# EAGLE design BLE_revb (EAGLE 7.7.0)

## Sheet 1 of 2
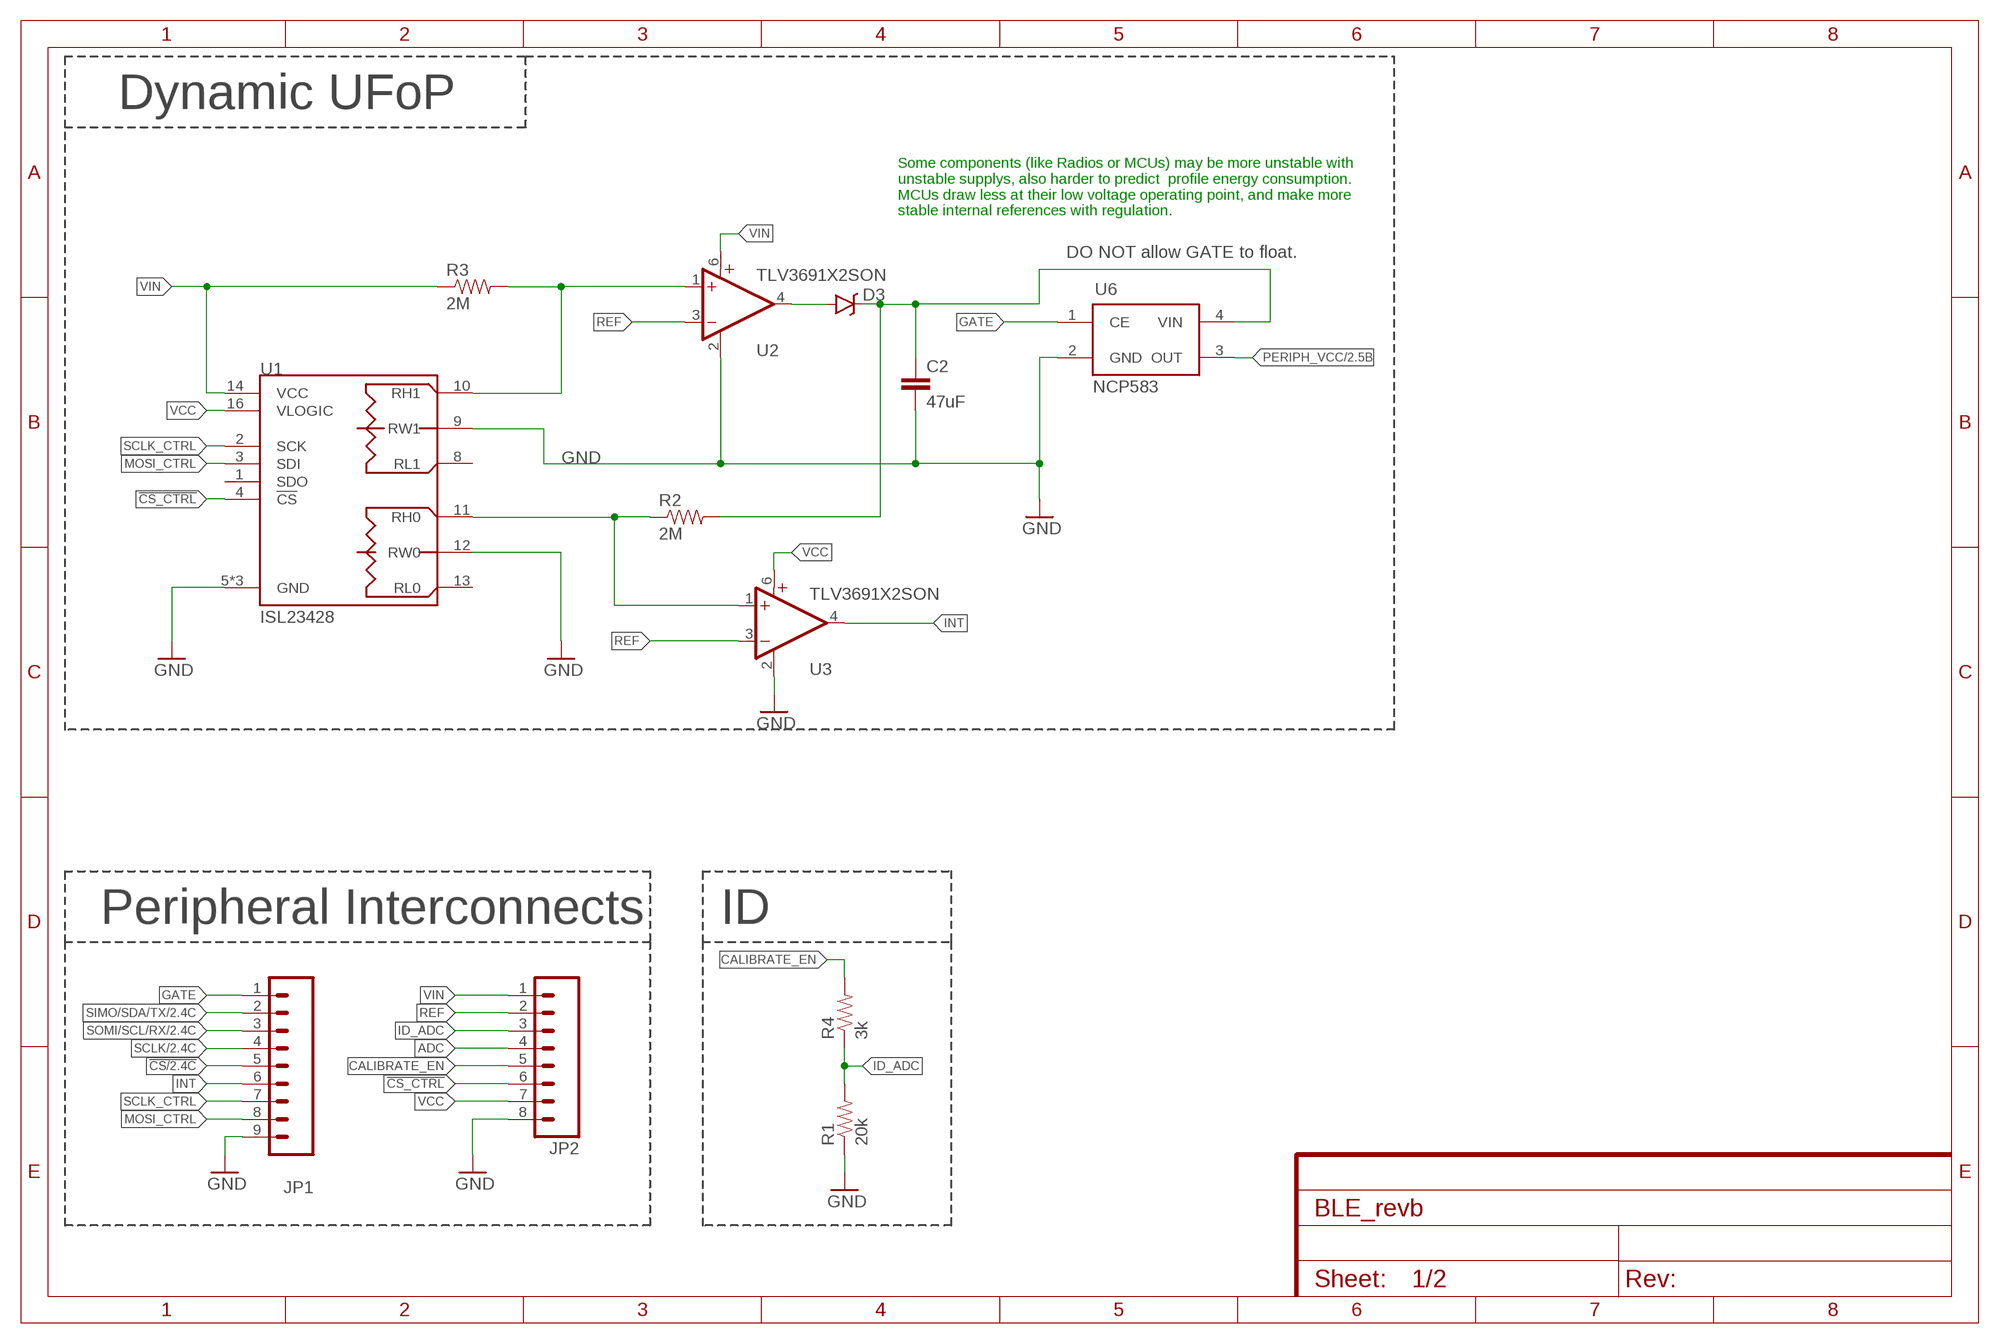
[diagram p0: schematic, sheet 1]
FRAME1 (FRAME-A4L): CNAME: BLE Peripheral, nRF51822; CREVISION: B; DESIGNER: Josiah Hester

### Parts
C2  47uF  CAP1206  [1206]
D3  RB751  DIODE-SCHOTTKY-RB751  [SOD-523]
JP1  M091.27MM  [1X09-1.27MM]
JP2  M081X08_1.27MM_SMD  [1X08_1.27MM_SMD]
R1  20k  R-EU  [0402]
R2  2M  R-EU  [0402]
R3  2M  R-EU  [0402]
R4  3k  R-EU  [0402]
U1  ISL23428  [UTQFN-16]
U2  TLV3691X2SON  [X2SON]
U3  TLV3691X2SON  [X2SON]
U6  NCP583  [SC82-AB_1PRIMARY]

### Nets
!CS: JP1.5 ; also sheet 2
!CS_CTRL: JP2.6 U1.4(!CS)
ADC: JP2.4
CALIBRATE_EN: JP2.5 R4.2
GATE: JP1.1 U6.1(CE)
GND: C2.2 JP1.9 JP2.8 R1.1 U1.5(GND) U1.6(GND) U1.9(RW1) U1.12(RW0) U1.15(GND) U2.2(GND) U3.2(GND) U6.2(GND) ; also sheet 2
ID_ADC: JP2.3 R1.2 R4.1
INT: JP1.6 U3.4(OUT)
MOSI_CTRL: JP1.8 U1.3(SDI)
N$2: C2.1 D3.C R2.2 U6.4(VIN)
N$4: R3.2 U1.10(RH1) U2.1(+IN)
N$5: R2.1 U1.11(RH0) U3.1(+IN)
N$7: D3.A U2.4(OUT)
PERIPH_VCC: U6.3(OUT) ; also sheet 2
REF: JP2.2 U2.3(-IN) U3.3(-IN)
SCLK: JP1.4 ; also sheet 2
SCLK_CTRL: JP1.7 U1.2(SCK)
SIMO/SDA/TX: JP1.2 ; also sheet 2
SOMI/SCL/RX: JP1.3 ; also sheet 2
VCC: JP2.7 U1.16(VLOGIC) U3.6(V+)
VIN: JP2.1 R3.1 U1.14(VCC) U2.6(V+)
Unconnected: U1.1(SDO) U1.8(RL1) U1.13(RL0)

### Notes on the sheet
- Dynamic UFoP
- Some components (like Radios or MCUs) may be more unstable with
  unstable supplys, also harder to predict  profile energy consumption. 
  MCUs draw less at their low voltage operating point, and make more 
  stable internal references with regulation.
- DO NOT allow GATE to float.
- Peripheral Interconnects | ID

## Sheet 2 of 2: Comms -- BLE
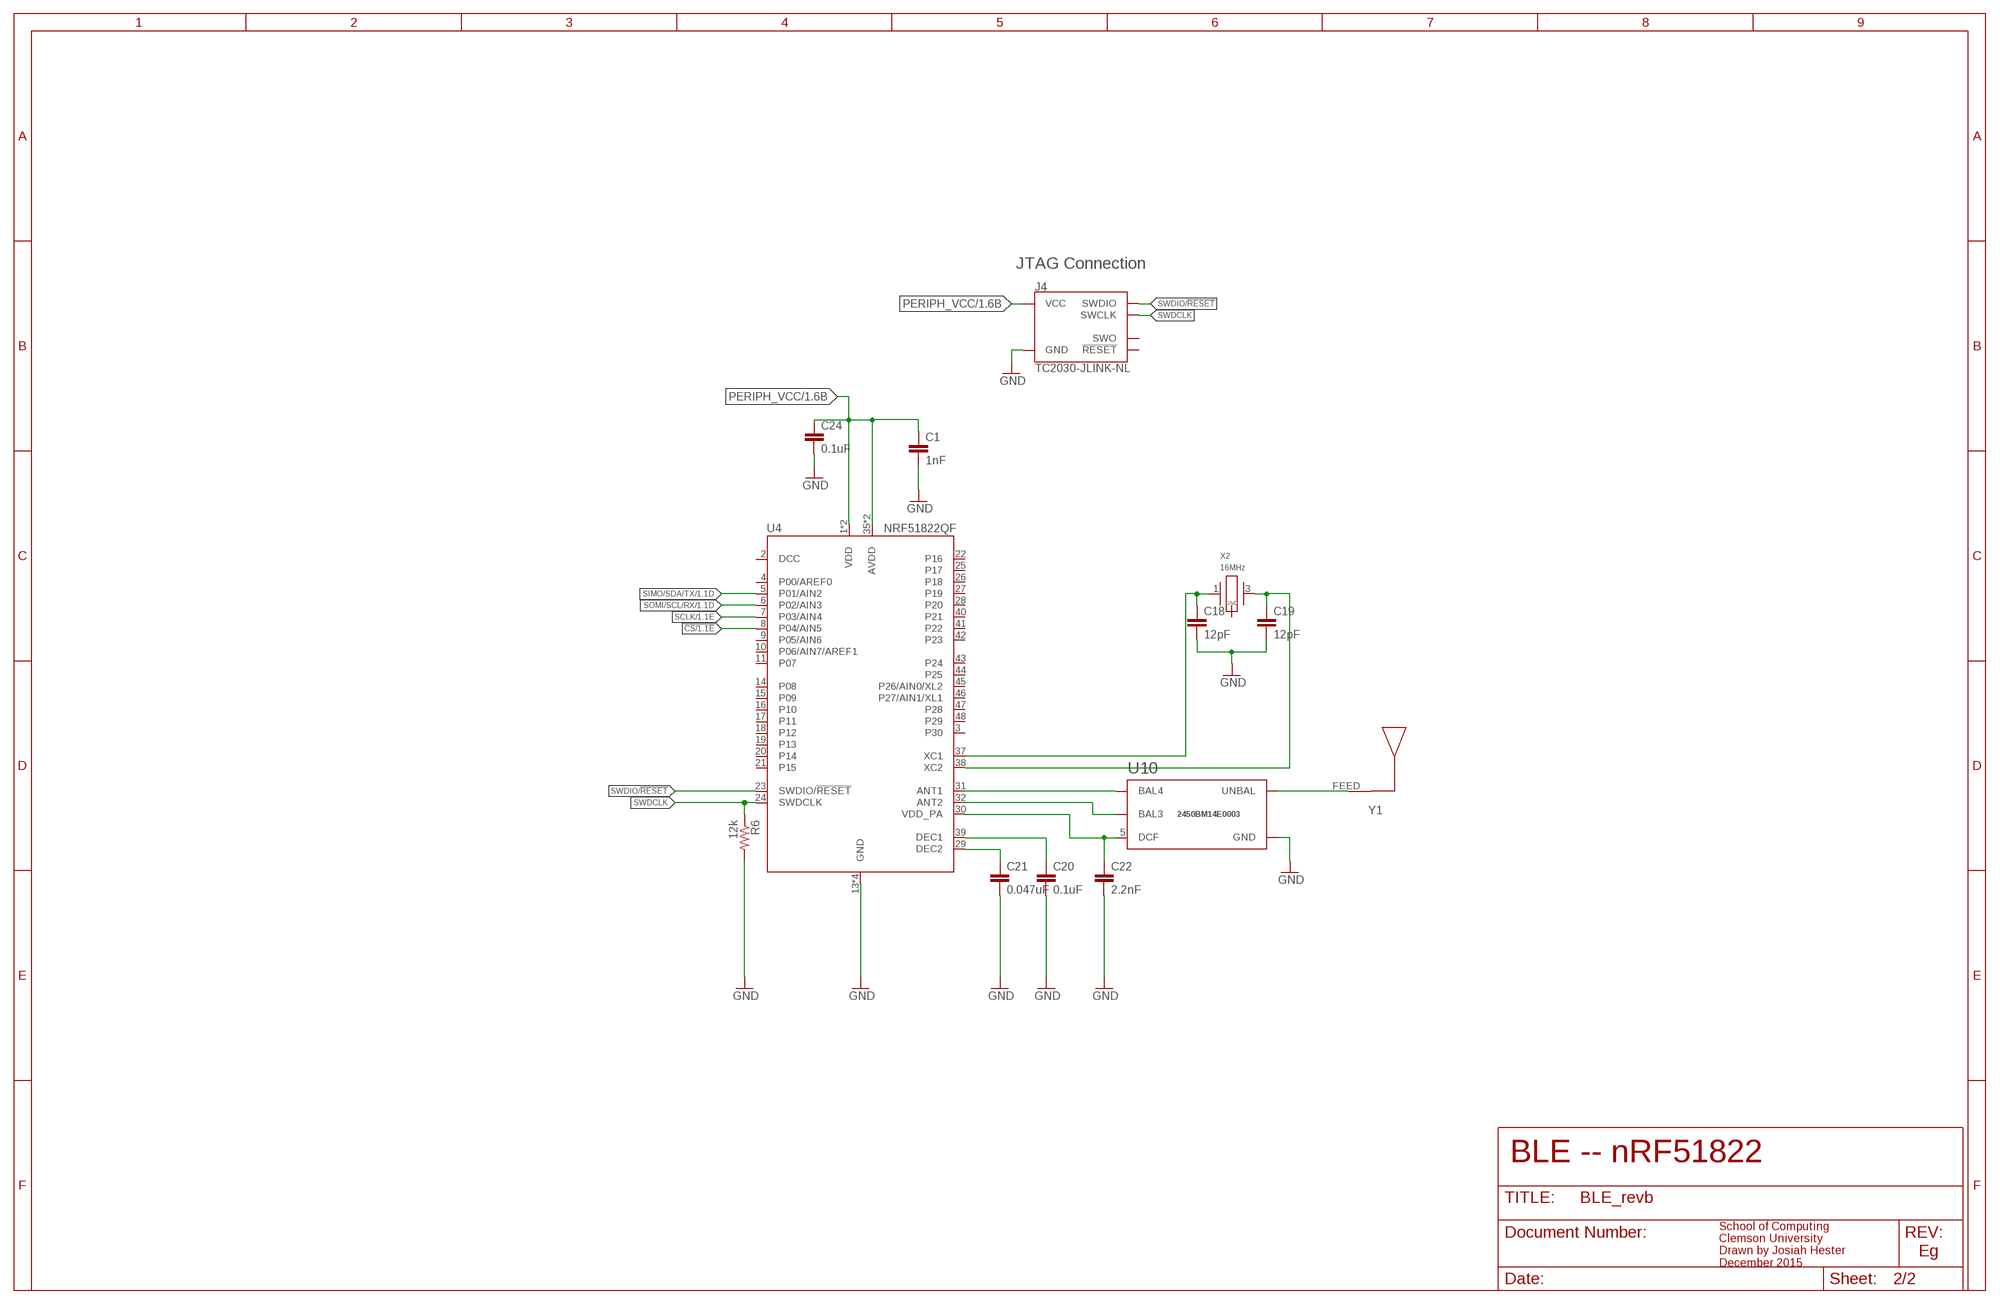
[diagram p1: schematic, sheet 2]

### Parts
C1  1nF  C-EU  [0402]
C18  12pF  C-EU  [0402]
C19  12pF  C-EU  [0402]
C20  0.1uF  C-EU  [0402]
C21  0.047uF  C-EU  [0402]
C22  2.2nF  C-EU  [0402]
C24  0.1uF  C-EU  [0402]
J4  TC2030-JLINK-NL  [TC2030-IDC-NL]
R6  12k  R-EU  [0402]
U4  NRF51822QF  [QFN-48-6MM]
U10  2450BM14E0003  [2450BM14E0003]
X2  16MHz  TXC-8Y  [TXC-8Y]
Y1  2450AT42A100E  [2450AT42A100]

### Nets
!CS: U4.8(P04/AIN5) ; also sheet 1
GND: C1.2 C18.2 C19.2 C20.2 C21.2 C22.2 C24.2 J4.5(GND) R6.2 U4.13(GND) U4.33(GND) U4.34(GND) U4.GND U10.2(GND) U10.6(GND) ; also sheet 1
N$11: U10.1(UNBAL) Y1.FEED(P1)
N$12: C22.1 U4.30(VDD_PA) U10.5(DCF)
N$13: U4.31(ANT1) U10.4(BAL4)
N$29: U4.32(ANT2) U10.3(BAL3)
N$31: C18.1 U4.37(XC1) X2.1
N$32: C19.1 U4.38(XC2) X2.3
N$33: C20.1 U4.39(DEC1)
N$34: C21.1 U4.29(DEC2)
PERIPH_VCC: C1.1 C24.1 J4.1(VCC) U4.1(VDD) U4.12(VDD) U4.35(AVDD) U4.36(AVDD) ; also sheet 1
SCLK: U4.7(P03/AIN4) ; also sheet 1
SIMO/SDA/TX: U4.5(P01/AIN2) ; also sheet 1
SOMI/SCL/RX: U4.6(P02/AIN3) ; also sheet 1
SWDCLK: J4.4(SWCLK) R6.1 U4.24(SWDCLK)
SWDIO/!RESET: J4.2(SWDIO) U4.23(SWDIO/!RESET)
Unconnected: J4.3(!RESET) J4.6(SWO) U4.2(DCC) U4.3(P30) U4.4(P00/AREF0) U4.9(P05/AIN6) U4.10(P06/AIN7/AREF1) U4.11(P07) U4.14(P08) U4.15(P09) U4.16(P10) U4.17(P11) U4.18(P12) U4.19(P13) U4.20(P14) U4.21(P15) U4.22(P16) U4.25(P17) U4.26(P18) U4.27(P19) U4.28(P20) U4.40(P21) U4.41(P22) U4.42(P23) U4.43(P24) U4.44(P25) U4.45(P26/AIN0/XL2) U4.46(P27/AIN1/XL1) U4.47(P28) U4.48(P29) X2.2(GND) X2.4(GND)

### Notes on the sheet
- JTAG Connection
- BLE -- nRF51822
- Eg
- School of Computing
  Clemson University
  Drawn by Josiah Hester
  December 2015

## Library data of the parts
C1 = tiny_passives:C-EU; DIGIKEY: 490-1303-1-ND; MPN: GRM155R71H102KA01D
C2 = SparkFun-Capacitors:CAP: Capacitor Standard 0603 ceramic capacitor, and 0.1" leaded capacitor.; DIGIKEY: 490-3907-1-ND; MPN: GRM31CR60J476ME19L
C18 C19 = tiny_passives:C-EU; DIGIKEY: 490-6197-1-ND; MPN: GRM1555C1H120GA01D
C20 = tiny_passives:C-EU; DIGIKEY: 490-1303-1-ND; MPN: 0402YD104KAT2A
C21 = tiny_passives:C-EU; DIGIKEY: 445-1264-1-ND; MPN: C1005X7R1C473K050BC
C22 = tiny_passives:C-EU; DIGIKEY: 490-5419-1-ND; MPN: GRM155R71E222KA01D
C24 = tiny_passives:C-EU; DIGIKEY: 445-4952-1-ND; MPN: 0402YD104KAT2A
D3 = SparkFun-DiscreteSemi:DIODE-SCHOTTKY: Schottky diodes in SFE's production catalog BAT20J 1A 23V 0.62Vf RB751 120mA 40V 0.37Vf PMEG4005EJ 0.5A 40V 0.42Vf MBRA140 1A 40V 0.5Vf B340A 3A 40V SMA; DIGIKEY: BAS40-02V-V-G-08GICT-ND; MPN: BAS40-02V-V-G-08; PROD_ID: DIO-11018
J4 = connector:TC2030-JLINK; DIGIKEY: NP
JP1 = SparkFun-Connectors:M09: Header 9 Standard 9-pin 0.1" header. Use with straight break away headers (SKU : PRT-00116), right angle break away headers (PRT-00553), swiss pins (PRT-00743), machine pins (PRT-00117), and female headers (PRT-00115).; MPN: GRPB091VWVN-RC
JP2 = SparkFun-Connectors:M08: Header 8 Standard 8-pin 0.1" header. Use with straight break away headers (SKU : PRT-00116), right angle break away headers (PRT-00553), swiss pins (PRT-00743), machine pins (PRT-00117), and female headers (PRT-00115).; MPN: GRPB081VWTC-RC
R1 = tiny_passives:R-EU; MPN: ERJ-2RKF2002X
R2 R3 = tiny_passives:R-EU; DIGIKEY: 1276-4293-1-ND; MPN: RC1005F205CS
R4 = tiny_passives:R-EU; MPN: RC0402JR-073KL
R6 = tiny_passives:R-EU; DIGIKEY: RHM12.0KCDCT-ND; MPN: MCR01MRTF1202
U1 = isl23428:ISL23428: Intersil: Dual, 128-Tap, Low Voltage Digitally Controlled Potentiometer The ISL23428 is a volatile, low voltage, low noise, low power, 128-tap, dual digitally controlled potentiometer (DCP) with an SPI Bus™ interface. It integrates two DCP cores, wiper switches and control logic on a monolithic CMOS integrated circuit. Each digitally controlled potentiometer is implemented with a combination of resistor elements and CMOS switches. The position of the wipers are controlled by the user through the SPI bus interface. Each potentiometer has an associated volatile Wiper Register (WRi, i = 0, 1) that can be directly written to and read by the user. The contents of the WRi controls the position of the wiper. When powered on, the wiper of each DCP will always commence at mid-scale (64 tap position). The low voltage, low power consumption, and small package of the ISL23428 make it an ideal choice for use in battery operated equipment. In addition, the ISL23428 has a VLOGIC pin allowing down to 1.2V bus operation, independent from the VCC value. This allows for low logic levels to be connected directly to the ISL23428 without passing through a voltage level shifter. The DCP can be used as a three-terminal potentiometer or as a two-terminal variable resistor in a wide variety of applications including control, parameter adjustments, and signal processing; DIGIKEY: ISL23428TFRUZ-T7ACT-ND; MPN: ISL23428TFRUZ-T7A
U2 U3 = tlv3691:TLV3691: 0.9-V to 6.5-V, Nanopower Comparator Datasheets Analog Signal Chain Guide <http://www.ti.com/lit/pdf/slyb174> TLV3691 <http://www.ti.com/lit/ds/symlink/tlv3691.pdf> Manufacturer Product Page TLV3691IDPFR Specifications <http://www.ti.com/general/docs/suppproductinfo.tsp?distId=10&orderablePartNumber=TLV3691IDPFR> Standard Package <javascript:dlgHelp('Standard%20Packaging%20Help');> 1 Category Integrated Circuits (ICs) </product-search/en/integrated-circuits-ics> Family Linear - Comparators </product-search/en/integrated-circuits-ics/linear-comparators/2556221> Series - Packaging <javascript:dlgHelp('Standard%20Packaging%20Help');> Cut Tape (CT) <javascript:dlgHelp('Cut%20Tape%20Help');> Type General Purpose Number of Elements 1 Output Type Push-Pull Voltage - Supply, Single/Dual (±) 0.9 V ~ 6.5 V, ±0.45 V ~ 3.25 V Voltage - Input Offset (Max) 3mV Current - Input Bias (Max) 100pA Current - Output (Typ) 42mA Current - Quiescent (Max) 150nA CMRR, PSRR (Typ) - Propagation Delay (Max) 35µs Hysteresis - Operating Temperature -40°C ~ 125°C Package / Case 6-XFDFN Mounting Type Surface Mount Supplier Device Package 6-X2SON (1x1) Online Catalog Comparators - 1 element </catalog/en/partgroup/comparators-1-element/3112?mpart=TLV3691IDPFR&vendor=296&WT.z_ref_page_type=PS&WT.z_ref_page_sub_type=PD&WT.z_ref_page_id=PD&WT.z_ref_page_event=DC_Link_Table> Other Names 296-37242-1; DIGIKEY: 296-37242-1-ND; MPN: TLV3691IDPFR
U4 = chips:NRF51822: Multiprotocol Bluetooth® 4.0 low energy/2.4 GHz RF SoC; DIGIKEY: 1490-1042-1-ND; MOUSER: 949-NRF51822-QFAB-R7; MPN: NRF51822-QFAC-R
U6 = ncp583:NCP583: NCP583 - Ultra-Low Iq 150 mA CMOS LDO Regulator with Enable The NCP583 series of low dropout regulators are designed for portable battery powered applications which require precise output voltage accuracy and low quiescent current. These devices feature an enable function which lowers current consumption significantly and are offered in two small packages; SC−82AB and the SOT−563. A 1.0 mF ceramic capacitor is the recommended value to be used with these devices on the output pin.; DIGIKEY: NCP583SQ18T1GOSCT-ND; MPN: NCP583SQ18T1G; PARTNUMBER: NCP583SQ18T1G
U10 = johansen-baluns:2450BM14E0003: 2.45GHz Impedance Matched Balun + Band Pass Filter: Optimized for Nordic's Chipsets: nRF51822-QFAA, nRF51422-QFAA, nRF51822-QFAB, nRF51422-QFAB, nRF51822-QFAC, and nRF51422-QFAC; MPN: 2450BM14E0003T
X2 = crystals:TXC-8Y: 2mmx1.6mm SMD Crystal; DIGIKEY: 887-2003-1-ND; MPN: 8Y-16.000MAAV-T
Y1 = johanson-antenna:2450AT42A100E: Johanson Technology Inc. 2450AT42A100E ANTENNA CHIP 2.4GHZ; DIGIKEY: 712-1007-1-ND; MPN: 2450AT42A100E

## Net classes
1 Ground: width 0.203 mm, drill 0.61 mm

## Board
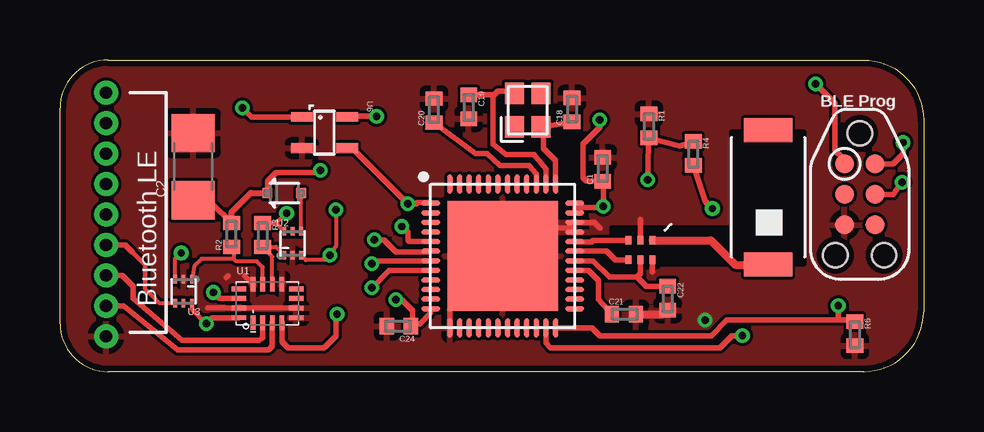
[diagram p2: board, top side]
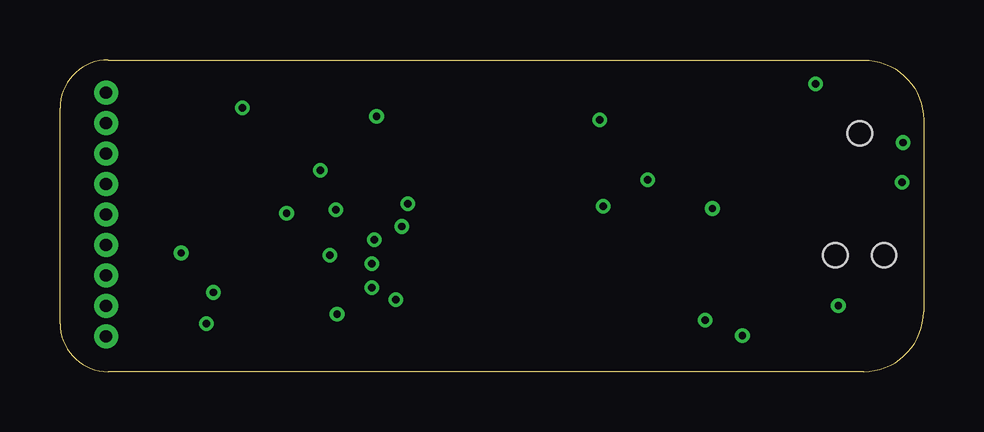
[diagram p3: board, inner layer Route2]
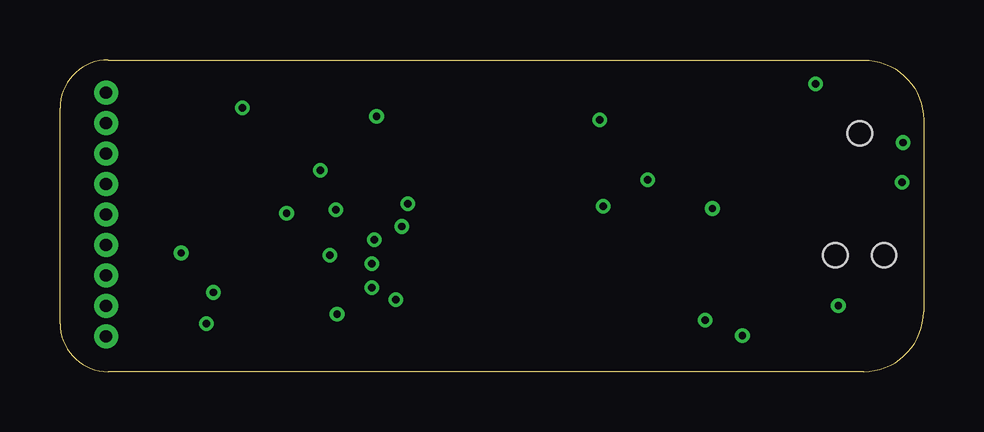
[diagram p4: board, inner layer Route15]
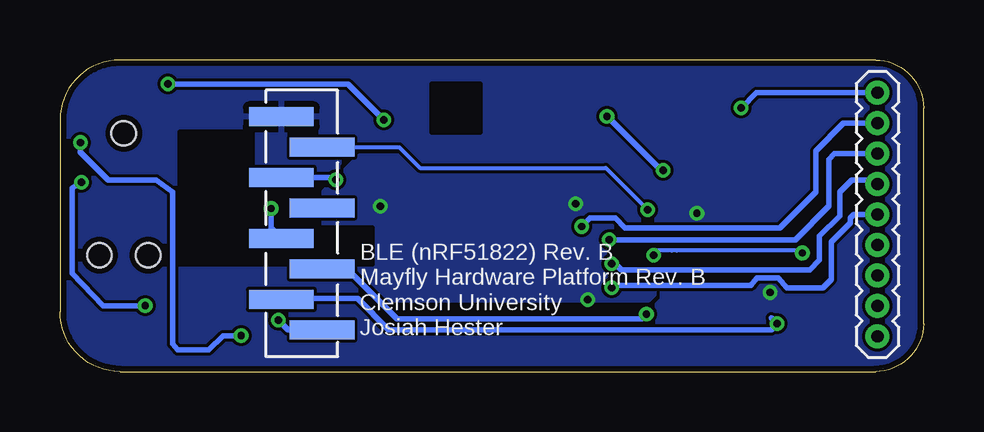
[diagram p5: board, bottom side, seen from below]

Size 36 x 13 mm. Coordinates in mm from the lower left corner, seen from the top.
Outline: 2,13 33.5,13 arc-90 36,10.5 36,2.5 arc-90 33.5,0 2,0 arc-90 0,2 0,11 arc-90 2,13
Copper layers (1*16): Top 0.035mm / dielectric 1.5mm / Bottom 0.035mm
Design rules "MF_Standard_2_Layer": minimum track width 5mil, minimum drill 12mil, track to track 5mil, track to pad 5mil, pad to pad 5mil, via to via 5mil, smd to smd 0mil, copper to edge 10mil, drill to drill 10mil, minimum pad ring 6mil, minimum via ring 6mil, stop-mask expansion 2mil, vias tented up to drill 25mil, thermal gap 10mil

### Footprints (pad centres in the part's own frame; a part is rotated, then mirrored left to right if it is on the bottom)
0402 = smd 0.6 x 0.7: 1 -0.5,0; 2 0.5,0
1206 = smd 1.6 x 1.8: 1 -1.4,0; 2 1.4,0
SOD-523 = smd 0.4 x 0.4: A -0.7,0; C 0.7,0
TC2030-IDC-NL = smd 0.787 x 0.787: 1 -1.27,-0.635; 2 -1.27,0.635; 3 0,-0.635; 4 0,0.635; 5 1.27,-0.635; 6 1.27,0.635 | hole 1.016: -2.54,0; 2.54,1.016; 2.54,-1.016
1X09-1.27MM = drill 0.508 pad 1: 1 0,0; 2 1.27,0; 3 2.54,0; 4 3.81,0; 5 5.08,0; 6 6.35,0; 7 7.62,0; 8 8.89,0; 9 10.16,0
1X08_1.27MM_SMD = smd 0.8 x 2.7: 1 0,-0.85; 2 1.27,0.85; 3 2.54,-0.85; 4 3.81,0.85; 5 5.08,-0.85; 6 6.35,0.85; 7 7.62,-0.85; 8 8.89,0.85
UTQFN-16 = smd 0.2 x 0.6: 1 -0.6,-0.8; 2 -0.2,-0.8; 3 0.2,-0.8; 4 0.6,-0.8; 9 0.6,0.8; 10 0.2,0.8; 11 -0.2,0.8; 12 -0.6,0.8 | smd 0.6 x 0.2: 5 1.2,-0.6; 6 1.2,-0.2; 7 1.2,0.2; 8 1.2,0.6; 13 -1.2,0.6; 14 -1.2,0.2; 15 -1.2,-0.2; 16 -1.2,-0.6
X2SON = smd 0.152 x 0.35: 1 -0.35,-0.5; 2 0,-0.5; 3 0.35,-0.5; 4 0.35,0.5; 5 0,0.5; 6 -0.35,0.5
QFN-48-6MM = smd 0.8 x 0.203: 1 -3,2.2; 2 -3,1.8; 3 -3,1.4; 4 -3,1; 5 -3,0.6; 6 -3,0.2; 7 -3,-0.2; 8 -3,-0.6; 9 -3,-1; 10 -3,-1.4; 11 -3,-1.8; 12 -3,-2.2; 25 3,-2.2; 26 3,-1.8; 27 3,-1.4; 28 3,-1; 29 3,-0.6; 30 3,-0.2; 31 3,0.2; 32 3,0.6; 33 3,1; 34 3,1.4; 35 3,1.8; 36 3,2.2 | smd 0.203 x 0.8: 13 -2.2,-3; 14 -1.8,-3; 15 -1.4,-3; 16 -1,-3; 17 -0.6,-3; 18 -0.2,-3; 19 0.2,-3; 20 0.6,-3; 21 1,-3; 22 1.4,-3; 23 1.8,-3; 24 2.2,-3; 37 2.2,3; 38 1.8,3; 39 1.4,3; 40 1,3; 41 0.6,3; 42 0.2,3; 43 -0.2,3; 44 -0.6,3; 45 -1,3; 46 -1.4,3; 47 -1.8,3; 48 -2.2,3 | smd 4.6 x 4.6: GND 0,0
SC82-AB_1PRIMARY = smd 0.406 x 0.914: 1 -0.621,-0.913; 2 0.675,-0.913; 3 0.675,0.967; 4 -0.621,0.967
2450BM14E0003 = smd 0.25 x 0.35: 1 0.5,0.405; 2 0,0.405; 3 -0.5,0.405; 4 -0.5,-0.405; 5 0,-0.405; 6 0.5,-0.405
TXC-8Y = smd 0.9 x 0.8: 1 -0.7,-0.55; 2 0.7,-0.55; 3 0.7,0.55; 4 -0.7,0.55
2450AT42A100 = smd 1 x 2.007: FEED 2.8,0; NC -2.8,0

### Placement (x,y rotation side)
C1  22.62,8.44 90 top
C2  5.55,8.55 90 top
C18  21.35,10.91 90 top
C19  17.04,11.04 270 top
C20  15.59,10.89 90 top
C21  23.51,2.39 0 top
C22  25.33,3.06 270 top
C24  14.13,1.9 180 top
D3  9.35,7.45 180 top
J4  33.34,7.39 270 top
JP1  1.92,11.63 270 bottom
JP2  25.92,10.63 270 bottom
R1  24.55,10.25 270 top
R2  7.15,5.7 90 top
R3  8.45,5.7 270 top
R4  26.4,9.1 270 top
R6  33.14,1.58 270 top
U1  8.65,2.85 0 top
U2  9.7,5.35 0 top
U3  5.15,3.35 180 top
U4  18.46,4.82 0 top
U6  11,10 270 top
U10  24.2,5.07 0 top
X2  19.5,10.9 90 top
Y1  29.52,7.27 270 top

### Tracks (layer width: path | path; a pad name or v marks a point on that pad's centre or on a via)
!CS  (via drill 0.3)
  Top 0.222: v13,3.5 13.72,4.22 U4.8
  Bottom 0.222: JP1.5 2.9,6.55 3.05,6.4 3.05,6.2 3.85,5.4 3.85,3.85 4.2,3.5 5.7,3.5 6.05,3.9 6.95,3.9 7.2,3.6 12.9,3.6 v13,3.5
!CS_CTRL  (via drill 0.3)
  Top 0.222: U1.4 9.25,1.25 9.5,1 11,1 11.5,1.5 11.5,2.35 v11.55,2.4
  Bottom 0.222: JP2.6 25.05,4.3 24.05,4.3 21.95,2.2 11.75,2.2 v11.55,2.4
CALIBRATE_EN  (via drill 0.3)
  Top 0.222: R4.2 26.9,7.1 v27.2,6.8
  Bottom 0.222: v27.2,6.8 27.2,5.98 JP2.5
GATE  (via drill 0.3)
  Top 0.222: U6.1 7.98,10.62 v7.6,11
  Bottom 0.222: v7.6,11 6.97,11.63 JP1.1
GND  (via drill 0.3)
  Top 0.222: U4.34 22.28,6.22 22.5,6 | U4.33 21.28,6 20.5,6 19.32,4.82 U4.GND 16.26,2.62 U4.13 | U10.2 24.2,6.35 | U10.6 24.7,4.15 | U1.6 U1.15 6.15,2.65 | U1.12 7.7,4 | 7,4 6.92,3.92
  Top 0.33: C21.2 25.17,2.39 C22.2
  Bottom 0.24: JP2.8 26.49,1.74 v26.9,2.15
  pour Top: -0.5,0 36.5,0 36.5,13.5 -0.5,13.5
ID_ADC  (via drill 0.3)
  Top 0.222: v24.5,8 24.5,8.85 R1.2 25.85,9.4 R4.1
  Bottom 0.222: JP2.3 24.59,8.09 v24.5,8
INT
  Top 0.16: U3.4 4.15,2.85 3.55,3.45 3.55,3.65
  Top 0.18: 3.55,3.65 3.55,4.45 3,5
  Top 0.222: 3,5 2.72,5.28 JP1.6
MOSI_CTRL
  Top 0.222: U1.3 8.85,1.05 8.7,0.9 4.9,0.9 2.66,2.74 JP1.8
N$1
  cutout Bottom: 23,6 28,6 28,10 31,10 31,4.5 23.5,4.5 23,4.5
N$2  (via drill 0.3)
  Top 0.222: D3.C 8.65,7.95 9,8.3 10.75,8.3 v10.85,8.4 | v13.2,10.65 12,10.65 U6.4
  Top 0.24: D3.C 7.95,7.45 7.15,6.65 R2.2 6.35,7 C2.1
  Bottom 0.222: v10.85,8.4 10.95,8.4 v13.2,10.65
N$3
  cutout Top: 23,6 28,6 28,10 31,10 31,4.5 23,4.5
N$4
  Top 0.16: U2.1 9,5.2 R3.2 8.85,4.8 U1.10
N$5
  Top 0.16: U1.11 8.45,4.35 8.2,4.6 7.35,4.6 7.25,4.7 | 7.25,4.7 7.25,5.1 R2.1 | 7.25,4.7 5.9,4.7 5.6,4.4 U3.1
N$6
  cutout Bottom: 18.5,12 20.5,12 20.5,10 18.5,10
N$7
  Top 0.16: U2.4 D3.A
N$11
  Top 0.33: U10.1 27.12,5.47 28.15,4.45 29.85,4.45 Y1.FEED
N$12
  Top 0.222: U4.30 22.23,4.62 22.9,3.95 24.05,3.95 | 24.05,3.95 24.2,4.1 U10.5 | C22.1 24.44,3.56 24.05,3.95
N$13
  Top 0.222: U4.31 22.78,5.02 23.15,4.65 23.68,4.65 U10.4
N$18
  cutout Route2: 0.3,-32.02 0.3,-24.62 5.4,-24.62 5.4,-23.82 8,-23.82 8,-25.72 3.6,-25.72 3.6,-32.02
N$21
  cutout Route15: 0.2,-24.62 0.2,-32.02 3.6,-32.02 3.6,-25.72 8,-25.72 8,-23.82 5.3,-23.82 5.3,-24.62
N$23
  cutout Route15: 7,-27.82 9.4,-27.82 9.4,-30.32 7,-30.32
N$24
  cutout Route2: 7,-27.82 9.4,-27.82 9.4,-30.32 7,-30.32
N$25
  cutout Route2: 11.8,-28.62 13.6,-28.62 13.6,-29.82 11.8,-29.82
N$26
  cutout Route15: 11.8,-28.62 13.6,-28.62 13.6,-29.82 11.8,-29.82
N$29
  Top 0.222: U10.3 22.23,5.47 22.15,5.4 21.48,5.4 U4.32
N$31
  Top 0.222: U4.37 20.66,8.79 20.15,9.3 20.15,10.3 X2.1 21.34,10.4 C18.1
N$32
  Top 0.222: U4.38 20.26,8.44 19.75,9.05 18.6,9.05 18.05,9.5 18.05,11.5 | 18.05,11.5 18.25,11.7 18.85,11.7 X2.3 | C19.1 18.01,11.54 18.05,11.5
N$33
  Top 0.222: U4.39 19.86,8.24 19.55,8.6 18.35,8.6 17.8,9.1 17.33,9.1 C20.1
N$34
  Top 0.222: U4.29 22.03,4.22 22.45,3.8 22.45,3 C21.1
PERIPH_VCC  (via drill 0.3)
  Top 0.2: U4.36 U4.35
  Top 0.222: U4.36 21.63,6.85 22.6,6.85 v22.65,6.9 22.65,7.91 C1.1 | v14.5,7 14.85,7 14.9,7.05 15.43,7.05 U4.1 | U4.12 15.46,2.46 15,2 14.73,2 C24.1 14.7,1.97 14.7,2.55 14.25,3 v14,3 | J4.1 32.88,8.66 32.3,9.25 32.3,11.2 v31.5,12 | 22.53,7.85 C1.1 | v22.5,10.5 22.5,10.2 21.8,9.5 21.8,8.1 21.95,7.95 22.61,7.95 C1.1 | U6.3 12.18,9.32 13.5,8
  Top 0.24: 13,8.5 13.5,8 v14.5,7
  Bottom 0.222: v31.5,12 24,12 v22.5,10.5
  pour Bottom: 14,9 23.5,9 25,7.5 25,4 24,3 11.5,3 11,3.5 11,6
REF  (via drill 0.3)
  Top 0.16: U3.3 4.8,4.7 v5.05,4.95
  Top 0.17: U2.3 10.25,4.65 11.25,4.65 v11.25,4.85 11.5,5.25 v11.5,6.75
  Bottom 0.17: v11.25,4.85 11.2,5.05 10.5,5.05 10.3,5.05 5.15,5.05 v5.05,4.95 | JP2.2 21.86,9.36 21,8.5 13.25,8.5 v11.5,6.75
SCLK  (via drill 0.3)
  Top 0.222: v13,4.5 13.12,4.62 U4.7
  Bottom 0.222: JP1.4 2.1,8 3,8 3.5,7.5 3.5,6.5 4.35,5.65 4.35,4.65 4.75,4.25 12.6,4.25 12.85,4.5 v13,4.5
SCLK_CTRL
  Top 0.222: U1.2 8.45,1.4 8.3,1.3 5.1,1.3 3.05,3.05 3.05,3.55 2.59,4.01 JP1.7
SIMO/SDA/TX  (via drill 0.3)
  Top 0.222: U4.5 14.58,5.42 14.5,5.5 14.5,5.8 v14.25,6.05
  Bottom 0.222: v14.25,6.05 13.9,6.4 12.85,6.4 12.45,6 12,6 6,6 4.5,7.5 4.5,9.2 3.34,10.36 JP1.2
SOMI/SCL/RX  (via drill 0.3)
  Top 0.222: v13.1,5.5 13.5,5.5 14,5 15.44,5 U4.6
  Bottom 0.222: v13.1,5.5 5.35,5.5 3.95,6.9 3.95,8.85 3.71,9.09 JP1.3
SWDCLK  (via drill 0.3)
  Top 0.222: U4.24 22.18,1.82 22.5,1.5 27.15,1.5 27.8,2.15 28.2,2.15 32.5,2.15 | 32.5,2.15 33.06,2.15 R6.1 | J4.4 34.74,7.39 v35.1,7.9 | v32.45,2.75 32.45,2.2 32.5,2.15
  Bottom 0.222: v32.45,2.75 34.2,2.75 35.5,4.1 35.5,7.65 v35.1,7.9
SWDIO/!RESET  (via drill 0.3)
  Top 0.222: U4.23 20.26,1.19 20.45,1 27.5,1 28,1.5 v28.45,1.5 | J4.2 34.72,8.66 35.15,9.1 v35.15,9.55
  Bottom 0.222: v28.45,1.5 29.2,1.5 29.8,0.9 31.1,0.9 31.3,1.15 31.3,7.5 32,8 34,8 35.15,9.15 v35.15,9.55
VCC  (via drill 0.3)
  Top 0.18: U3.6 5.5,2.6 v6.1,2
  Top 0.222: v6.1,2 6.35,2.25 U1.16
  Bottom 0.222: JP2.7 26,3 25.95,3.05 23.6,3.05 22.3,1.75 6.35,1.75 v6.1,2 6.35,2.25
VIN  (via drill 0.3)
  Top 0.16: R3.1 9,6.2 | 9,6.2 U2.6 | v9.45,6.6 9.3,6.5 9,6.2
  Top 0.222: U1.14 6.65,3.05 v6.4,3.3
  pour Bottom (rank 2): 0,0 36.5,0 36.5,13.5 0,13.5

### Text on the board
tPlace: BLE Prog | Bluetooth LE
bPlace: BLE (nRF51822) Rev. B / Mayfly Hardware Platform Rev. B / Clemson University / Josiah Hester